# EasyEDA schematic SCH_CarPCB_2023-11-15.json
TITLE: Sheet_1; REV: 1.0; Date: 2023-11-13; Sheet: 1/1; Company: Your Company
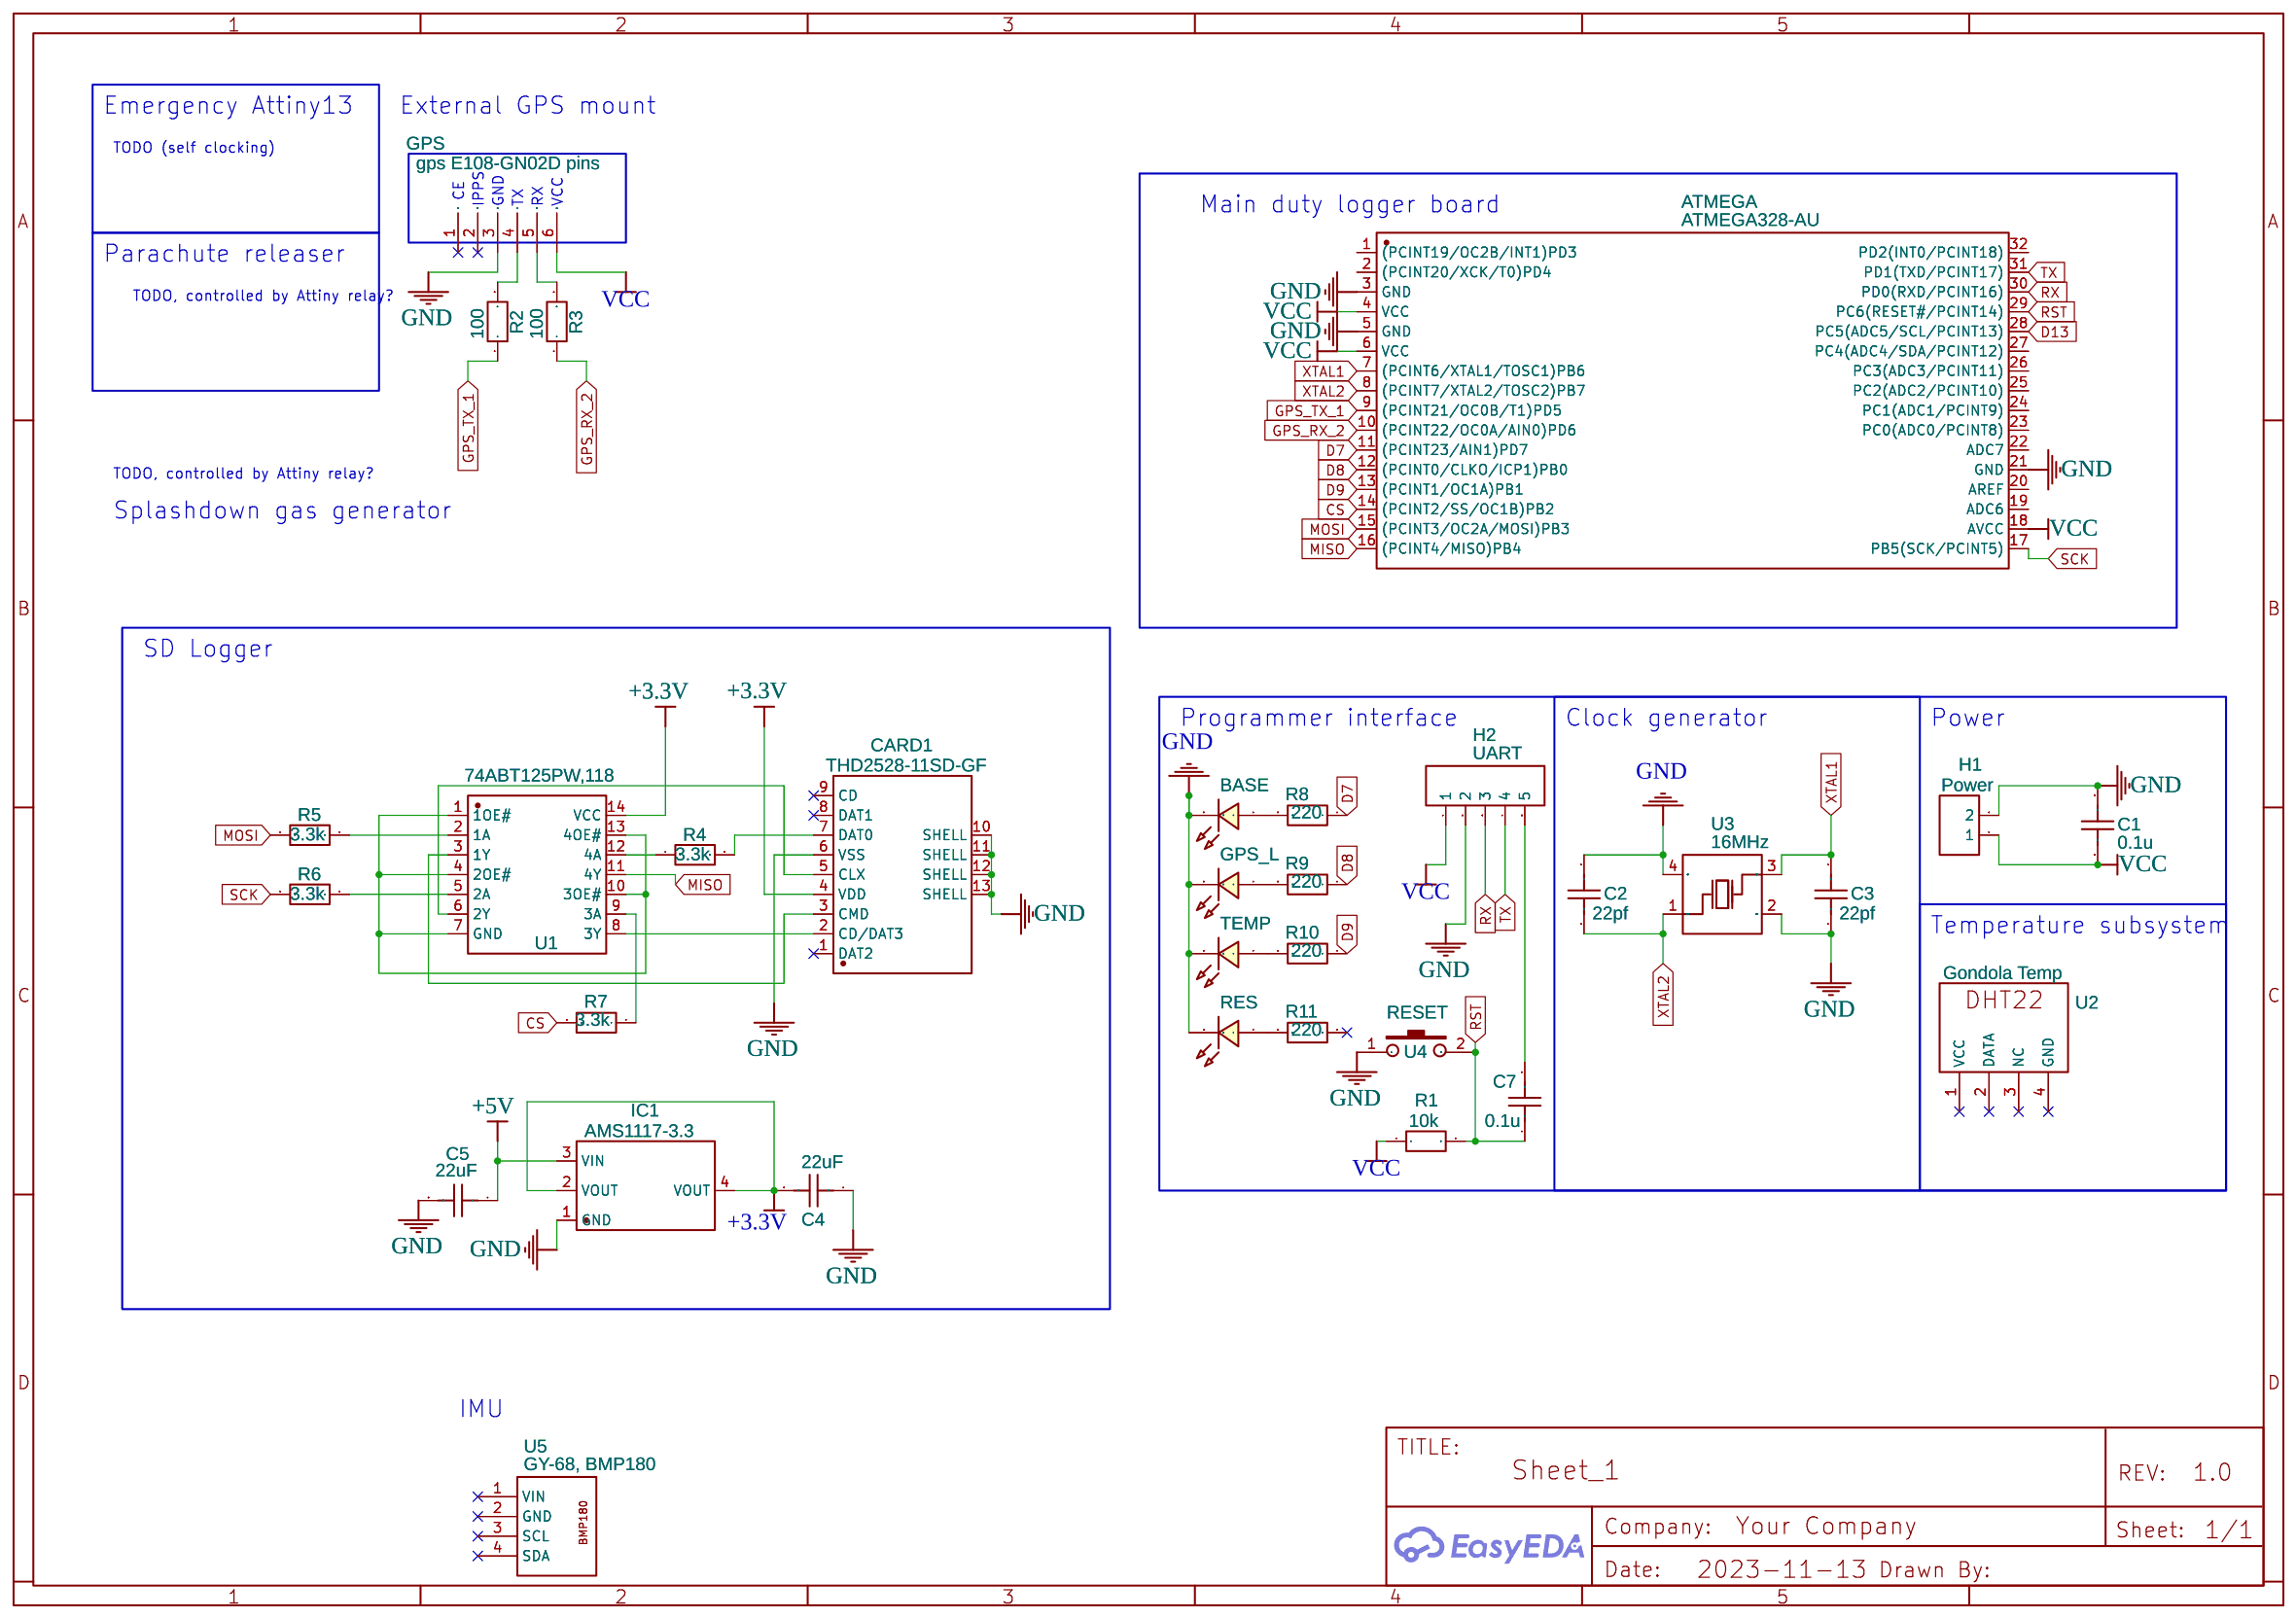
[diagram p0: schematic sheet]

## Parts
ATMEGA  ATMEGA328-AU  [TQFP-32_L7.0-W7.0-P0.80-LS9.0-BL]
BASE  GPS  [LED0603_RED]
C1  0.1u  [C0603]
C2  22pf  [C0603]
C3  22pf  [C0603]
C4  22uF  [C0603]
C5  22uF  [C0603]
C7  0.1u  [C0603]
CARD1  THD2528-11SD-GF  [TF-SMD_THD2528-11SD-GF]
GPS  gps E108-GN02D pins  [FEMALE_PIN_HEADER_7PIN]
GPS_L  GPS  [LED0603_RED]
H1  Power  [HDR-F-2.54_1X2]
H2  UART  [HDR-F-2.54_1X5]
IC1  AMS1117-3.3  [AMS1117-3.3]
R1  10k  [R0603]
R2  100  [R0603]
R3  100  [R0603]
R4  3.3k  [R0603]
R5  3.3k  [R0603]
R6  3.3k  [R0603]
R7  3.3k  [R0603]
R8  220  [R0603]
R9  220  [R0603]
R10  220  [R0603]
R11  220  [R0603]
RES  GPS  [LED0603_RED]
TEMP  GPS  [LED0603_RED]
U1  74ABT125PW,118  [TSSOP-14_L5.0-W4.4-P0.65-LS6.4-BL]
U2  Gondola Temp  [SENSOR-TH_HAIGU_DHT22]
U3  16MHz  [CRYSTAL-SMD_4P-L2.5-W2.0-BL-2]
U4  RESET  [KEY-SMD_L6.1-W3.7-P7.80-LS8.0]
U5  GY-68, BMP180  [BMP180]

## Library data of the parts
ATMEGA = ATMEGA328-AU: Contributor: LCSC; Supplier: LCSC; Supplier Part: C618731; Manufacturer: MICROCHIP(美国微芯); JLCPCB Part Class: Extended Part; link: https://lcsc.com/eda_search?q=C618731&%26type=1&ref=editor
BASE GPS_L RES TEMP = LED-0603_R: Manufacturer: EVERLIGHT(台湾亿光); Manufacturer Part: 19-217/R6C-AL1M2VY/3T; Supplier Part: C72044; Supplier: LCSC; Contributor: LCEDA_01
C1-C5 C7 = C_0603_US: Contributor: LCEDA_Lib
CARD1 = THD2528-11SD-GF: Supplier: LCSC; Supplier Part: C283232; Manufacturer: THD; Contributor: GreddyGlutton
GPS = Header_6: Manufacturer Part: New SchematicLib; Contributor: AkhondokeR1971
H1 = HDR-F-2.54_1x2: Supplier Part: C49661; Supplier: LCSC; Contributor: LCEDA_Lib
H2 = HDR-F-2.54_1x5: Supplier Part: C50950; Supplier: LCSC; Contributor: LCEDA_Lib
IC1 = AMS1117-3.3: Contributor: Arquimedes Paschoal; Package Display: No
R1-R11 = R_0603_EU: Contributor: LCEDA_Lib
U1 = 74ABT125PW,118: Supplier: LCSC; Supplier Part: C458207; Manufacturer: Nexperia; Contributor: Hamtu
U2 = DHT22: Digital-output relative humidity & temperature sensor/module; sourceId: GkiDrp9vf; Supplier Part: PRODUCT ID: 385; Voltage: 3.3V - 5.5V; Mounted: Yes; Manufacturer: Aosong (Guangzhou) Electronics Co., Ltd.; link: https://cdn-shop.adafruit.com/datasheets/DHT22.pdf; Contributor: pierrecainnov
U3 = NX2520SA-16MHZ-STD-CSW-4: Contributor: lcsc; Supplier: LCSC; Supplier Part: C1985890; Manufacturer: NDK; JLCPCB Part Class: Extended Part; link: https://lcsc.com/eda_search?q=C1985890&%26type=1&ref=editor
U4 = KEY-2PINRESET: Contributor: lcsc; Supplier: LCSC; Supplier Part: C9900007721; Manufacturer: null; Manufacturer Part: key-2pinRESET; JLCPCB Part Class: Extended Part; link: https://lcsc.com/eda_search?q=C9900007721&%26type=1&ref=editor
U5 = GY-68, BMP180: Contributor: delil1220

## Nets
+3.3V: C4.2 CARD1.4(VDD) IC1.2(VOUT) IC1.4(VOUT) U1.14(VCC)
+5V: C5.1 IC1.3(VIN)
GND: ATMEGA.3(GND) ATMEGA.5(GND) ATMEGA.21(GND) BASE.2 C1.2 C2.2 C3.1 C4.1 C5.2 CARD1.6(VSS) CARD1.10(SHELL) CARD1.11(SHELL) CARD1.12(SHELL) CARD1.13(SHELL) GPS.3 GPS_L.2 H1.2 H2.2 IC1.1(GND) RES.2 TEMP.2 U3.2(GND) U3.4(GND) U4.1
VCC: ATMEGA.4(VCC) ATMEGA.6(VCC) ATMEGA.18(AVCC) C1.1 GPS.6 H1.1 H2.1 R1.1
CS: ATMEGA.14((PCINT2/SS/OC1B)PB2) R7.2
D7: ATMEGA.11((PCINT23/AIN1)PD7) R8.1
D8: ATMEGA.12((PCINT0/CLKO/ICP1)PB0) R9.1
D9: ATMEGA.13((PCINT1/OC1A)PB1) R10.1
D13: ATMEGA.28(PC5(ADC5/SCL/PCINT13))
GPS_RX_2: ATMEGA.10((PCINT22/OC0A/AIN0)PD6) R3.1
GPS_TX_1: ATMEGA.9((PCINT21/OC0B/T1)PD5) R2.1
MISO: ATMEGA.16((PCINT4/MISO)PB4) U1.11(4Y)
MOSI: ATMEGA.15((PCINT3/OC2A/MOSI)PB3) R5.2
RST: ATMEGA.29(PC6(RESET#/PCINT14)) C7.1 R1.2 U4.2
RX: ATMEGA.30(PD0(RXD/PCINT16)) H2.3
SCK: ATMEGA.17(PB5(SCK/PCINT5)) R6.2
TX: ATMEGA.31(PD1(TXD/PCINT17)) H2.4
XTAL1: ATMEGA.7((PCINT6/XTAL1/TOSC1)PB6) C3.2 U3.3(OSC2)
XTAL2: ATMEGA.8((PCINT7/XTAL2/TOSC2)PB7) C2.1 U3.1(OSC1)
Net-(BASE-1): BASE.1 R8.2
Net-(C7-2): C7.2 H2.5
Net-(CARD1-2): CARD1.2(CD/DAT3) U1.8(3Y)
Net-(CARD1-3): CARD1.3(CMD) U1.3(1Y)
Net-(CARD1-5): CARD1.5(CLX) U1.6(2Y)
Net-(CARD1-7): CARD1.7(DAT0) R4.2
Net-(GPS-4): GPS.4 R2.2
Net-(GPS-5): GPS.5 R3.2
Net-(GPS_L-1): GPS_L.1 R9.2
Net-(R4-1): R4.1 U1.12(4A)
Net-(R5-1): R5.1 U1.2(1A)
Net-(R6-1): R6.1 U1.5(2A)
Net-(R7-1): R7.1 U1.9(3A)
Net-(R10-2): R10.2 TEMP.1
Net-(R11-2): R11.2 RES.1
Net-(U1-1): U1.1(1OE#) U1.4(2OE#) U1.7(GND) U1.10(3OE#) U1.13(4OE#)

Not connected (* = marked no-connect by the designer): ATMEGA 1((PCINT19/OC2B/INT1)PD3) 2((PCINT20/XCK/T0)PD4) 19(ADC6) 20(AREF) 22(ADC7) 23(PC0(ADC0/PCINT8)) 24(PC1(ADC1/PCINT9)) 25(PC2(ADC2/PCINT10)) 26(PC3(ADC3/PCINT11)) 27(PC4(ADC4/SDA/PCINT12)) 32(PD2(INT0/PCINT18)); CARD1 1(DAT2)* 8(DAT1)* 9(CD)*; GPS 1* 2*; R11 1*; U2 1(VCC)* 2(DATA)* 3(NC)* 4(GND)*; U5 1(VIN)* 2(GND)* 3(SCL)* 4(SDA)*

## Notes on the sheet
- Emergency Attiny13
- External GPS mount
- TODO (self clocking)
- CE
- IPPS
- GND
- TX
- RX
- VCC
- Main duty logger board
- Parachute releaser
- TODO, controlled by Attiny relay?
- TODO, controlled by Attiny relay?
- Splashdown gas generator
- SD Logger
- Programmer interface
- Clock generator
- Power
- Temperature subsystem
- IMU
